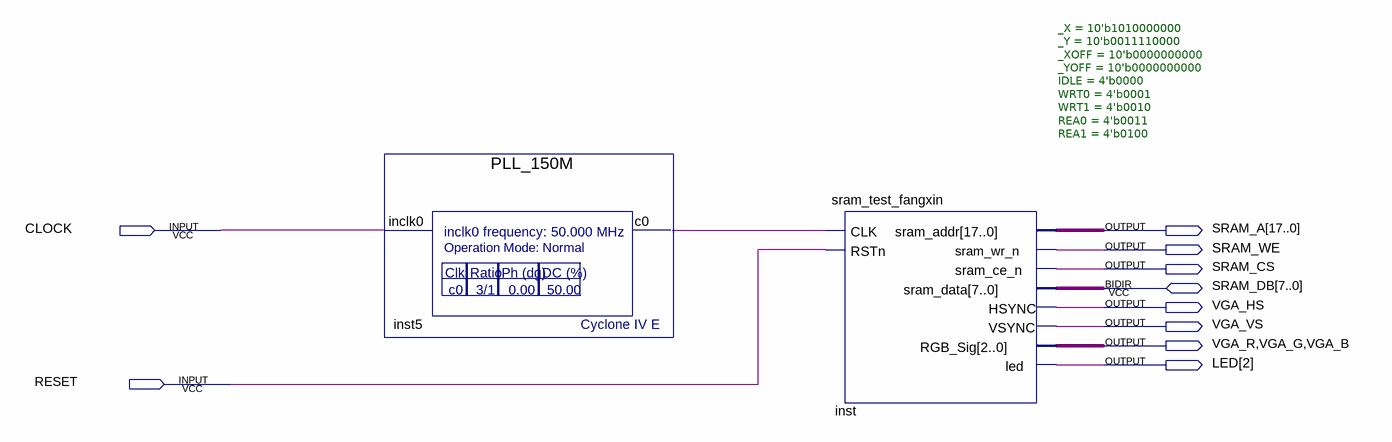
[diagram p0: schematic sheet]
// Quartus schematic SRAM_VGA_BDF.bdf as structural Verilog: 2 symbols, 10 pins
module SRAM_VGA_BDF (
  input  CLOCK,
  input  RESET,
  inout  [7:0] SRAM_DB,
  output [17:0] SRAM_A,
  output SRAM_WE,
  output SRAM_CS,
  output VGA_HS,
  output VGA_VS,
  output VGA_R,
  output VGA_G,
  output VGA_B,
  output [2:2] LED
);

  wire inst5_c0;

  PLL_150M inst5 (.inclk0(CLOCK), .c0(inst5_c0));
  sram_test_fangxin #(._X(10'b1010000000), ._Y(10'b0011110000), ._XOFF(10'b0000000000), ._YOFF(10'b0000000000), .IDLE(4'b0000), .WRT0(4'b0001), .WRT1(4'b0010), .REA0(4'b0011), .REA1(4'b0100)) inst (
    .CLK(inst5_c0), .RSTn(RESET), .sram_addr(SRAM_A), .sram_wr_n(SRAM_WE), .sram_ce_n(SRAM_CS),
    .HSYNC(VGA_HS), .VSYNC(VGA_VS), .RGB_Sig({VGA_R, VGA_G, VGA_B}), .led(LED[2]), .sram_data(SRAM_DB));
endmodule
